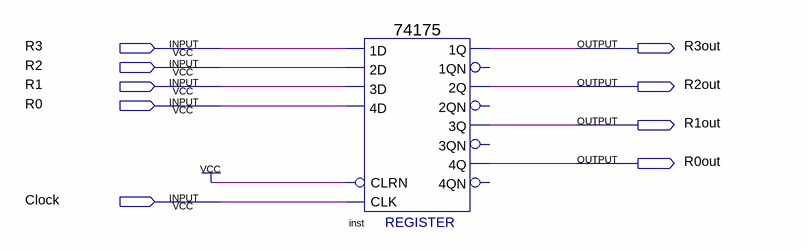
[diagram p0: schematic sheet]
// Quartus schematic Buffer_Register.bdf as structural Verilog: 1 symbols, 9 pins
module Buffer_Register (
  input  R3,
  input  R2,
  input  R1,
  input  R0,
  input  Clock,
  output R3out,
  output R2out,
  output R1out,
  output R0out
);

  \74175  inst (
    .CLRN(1'b1), .CLK(Clock), .\3D (R1), .\2D (R2), .\1D (R3), .\4D (R0), .\1Q (R3out), .\3Q (R1out),
    .\2Q (R2out), .\4Q (R0out));  // open: 1QN, 2QN, 4QN, 3QN
endmodule
